# EAGLE design roboteq led (EAGLE 6.2)
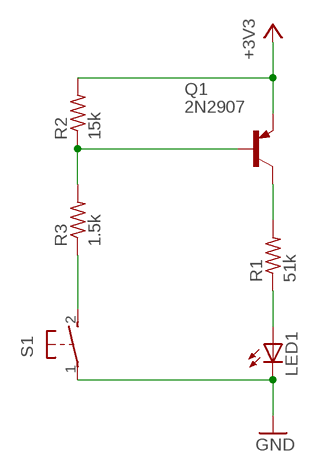
[diagram p0: schematic, sheet 1]

## Parts
LED1  LED  [SMARTLED-TTW]
Q1  2N2907  [TO92-EBC-OVAL]
R1  51k  R-US_0204/2V  [0204V]
R2  15k  R-US_0204/2V  [0204V]
R3  1.5k  R-US_0204/2V  [0204V]
S1  31-XX  [B3F-31XX]

## Nets
+3V3: Q1.E R2.2
GND: LED1.C@1(C) S1.1(P)
N$1: Q1.C R1.2
N$2: LED1.A@1(A) R1.1
N$3: Q1.B R2.1 R3.2
N$4: R3.1 S1.2(S)

## Library data of the parts
LED1 = adafruit:LED: LED OSRAM: - CHIPLED LG R971, LG N971, LY N971, LG Q971, LY Q971, LO R971, LY R971 LH N974, LH R974 LS Q976, LO Q976, LY Q976 LO Q996 - Hyper CHIPLED LW Q18S LB Q993, LB Q99A, LB R99A - SideLED LS A670, LO A670, LY A670, LG A670, LP A670 LB A673, LV A673, LT A673, LW A673 LH A674 LY A675 LS A676, LA A676, LO A676, LY A676, LW A676 LS A679, LY A679, LG A679 - Hyper Micro SIDELED® LS Y876, LA Y876, LO Y876, LY Y876 LT Y87S - SmartLED LW L88C, LW L88S LB L89C, LB L89S, LG L890 LS L89K, LO L89K, LY L89K LS L896, LA L896, LO L896, LY L896 - TOPLED LS T670, LO T670, LY T670, LG T670, LP T670 LSG T670, LSP T670, LSY T670, LOP T670, LYG T670 LG T671, LOG T671, LSG T671 LB T673, LV T673, LT T673, LW T673 LH T674 LS T676, LA T676, LO T676, LY T676, LB T676, LH T676, LSB T676, LW T676 LB T67C, LV T67C, LT T67C, LS T67K, LO T67K, LY T67K, LW E67C LS E67B, LA E67B, LO E67B, LY E67B, LB E67C, LV E67C, LT E67C LW T67C LS T679, LY T679, LG T679 LS T770, LO T770, LY T770, LG T770, LP T770 LB T773, LV T773, LT T773, LW T773 LH T774 LS E675, LA E675, LY E675, LS T675 LS T776, LA T776, LO T776, LY T776, LB T776 LHGB T686 LT T68C, LB T68C - Hyper Mini TOPLED® LB M676 - Mini TOPLED Santana® LG M470 LS M47K, LO M47K, LY M47K Source: http://www.osram.convergy.de/
Q1 = adafruit:2N2907*: PNP Transistor Big Oval pads
R1-R3 = adafruit:R-US_: RESISTOR, American symbol
S1 = adafruit:31-XX: OMRON SWITCH Now with beefier pads!

## Board
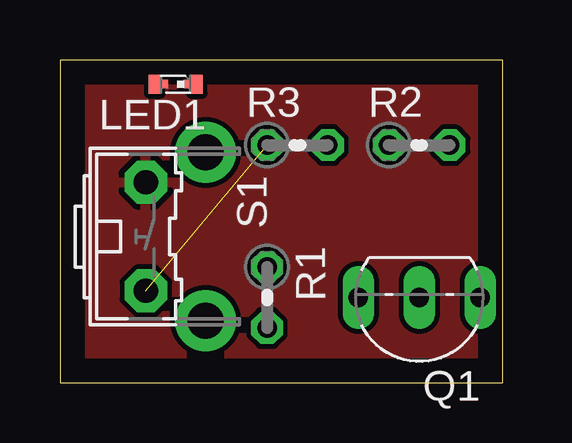
[diagram p1: board, top side]
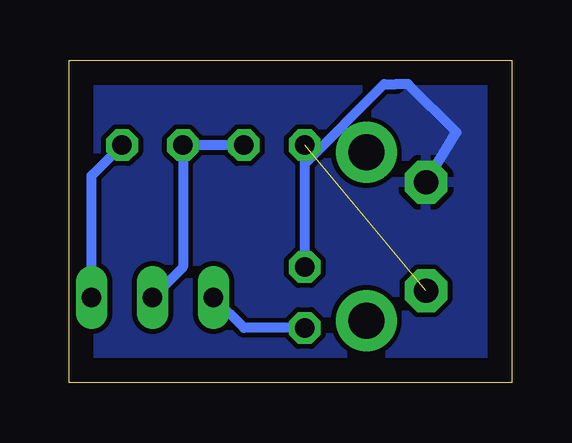
[diagram p2: board, bottom side, seen from below]

Size 18.47 x 13.45 mm. Coordinates in mm from the lower left corner, seen from the top.
Outline: 0,0 18.47,0 18.47,13.45 0,13.45 0,0
Copper layers (1*16): Top 0.035mm / dielectric 1.5mm / Bottom 0.035mm
Design rules: minimum track width 10mil, minimum drill 24mil, track to track 8mil, track to pad 8mil, pad to pad 8mil, via to via 8mil, smd to smd 8mil, copper to edge 40mil, drill to drill 8mil, minimum pad ring 10mil, minimum via ring 8mil, stop-mask expansion 4mil, vias tented up to drill 0mil, thermal gap 10mil

### Footprints (pad centres in the part's own frame; a part is rotated, then mirrored left to right if it is on the bottom)
SMARTLED-TTW = smd 0.8 x 0.5: A 0,-0.875; C 0,0.875 | smd 0.35 x 0.35: A@1 0,-0.5; C@1 0,0.5
TO92-EBC-OVAL = drill 0.813 long: B 0,-1.27; C 2.54,-1.27; E -2.54,-1.27
0204V = drill 0.813 octagon: 1 -1.27,0; 2 1.27,0
B3F-31XX = drill 1.016 pad 1.778 octagon: 1 -2.261,-1.245; 2 2.261,-1.245 | drill 1.499 pad 2.54: 3 -3.505,1.245; 4 3.505,1.245

### Placement (x,y rotation side)
LED1  4.83,12.45 90 top
Q1  14.99,2.29 180 top
R1  8.64,3.56 270 top
R2  14.99,9.91 0 top
R3  9.91,9.91 0 top
S1  4.83,6.1 270 top

### Tracks (layer width: path | path; a pad name or v marks a point on that pad's centre or on a via)
+3V3
  Bottom 0.406: Q1.E 17.53,8.64 R2.2
GND  (1 unrouted)
  Bottom 0.406: S1.1 2.31,10.43 LED1.C@1 4.83,12.45
  pour Top: 0,13.46 18.54,13.46 18.54,0 0,0
  pour Bottom: 0,13.46 18.54,13.46 18.54,0 0,0
N$1
  Bottom 0.406: R1.2 11.18,2.29 Q1.C
N$2  (1 unrouted)
  Bottom 0.406: R1.1 8.64,9.14 LED1.A@1 4.83,12.45
N$3
  Bottom 0.406: R3.2 R2.1 13.72,4.83 Q1.B
N$4  (1 unrouted)